# Altium schematic sheet analog.SchDoc
size A4
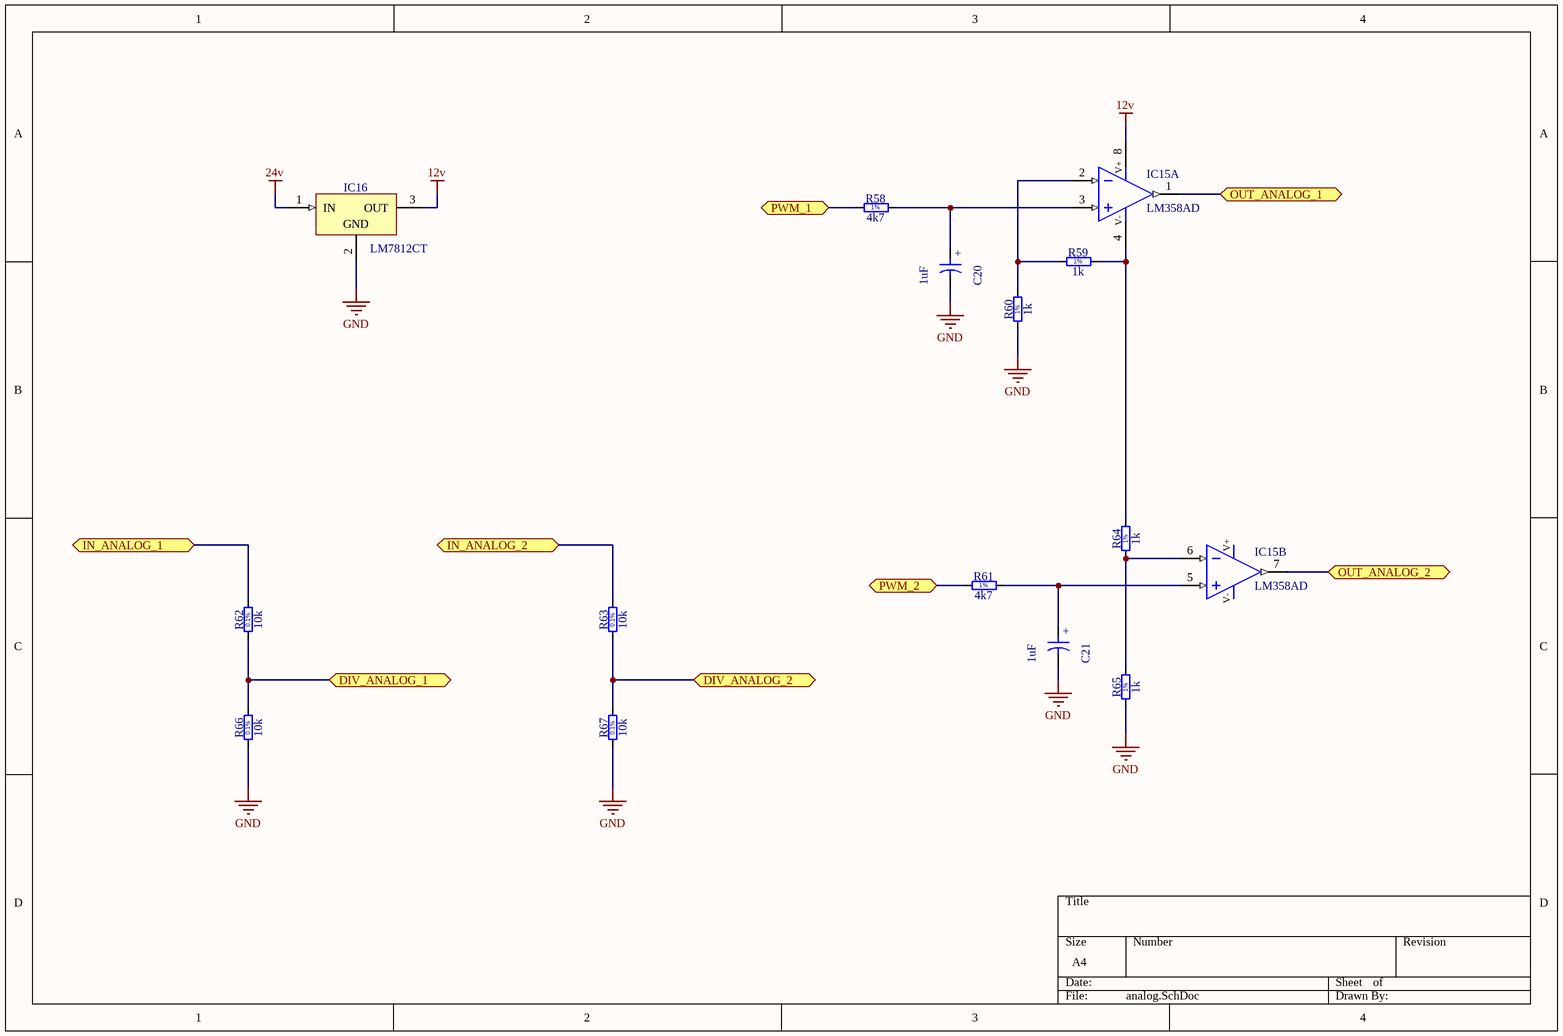
[diagram p0: analog.SchDoc]

## Parts
C20  1uF  [CAPPRB254-450X710]
C21  1uF  [CAPPRB254-450X710]
IC15  LM358AD  [SOIC127P600X175-8N]  (parts A,B of 2)
IC16  LM7812CT  [TO-220-V]
R58  4k7  [RESC2012X60N]
R59  1k  [RESC2012X60N]
R60  1k  [RESC2012X60N]
R61  4k7  [RESC2012X60N]
R62  10k  [RESC2012X60N]
R63  10k  [RESC2012X60N]
R64  1k  [RESC2012X60N]
R65  1k  [RESC2012X60N]
R66  10k  [RESC2012X60N]
R67  10k  [RESC2012X60N]

## Ports
DIV_ANALOG_1, DIV_ANALOG_2, IN_ANALOG_1, IN_ANALOG_2, OUT_ANALOG_1, OUT_ANALOG_2, PWM_1, PWM_2

## Nets
12v: IC15.8(V+) IC16.3(OUT)
24v: IC16.1(IN)
GND: C20.2 C21.2 IC16.2(GND) R60.1 R65.1 R66.1 R67.1
DIV_ANALOG_1: R62.1 R66.2 ; port DIV_ANALOG_1
DIV_ANALOG_2: R63.1 R67.2 ; port DIV_ANALOG_2
IN_ANALOG_1: R62.2 ; port IN_ANALOG_1
IN_ANALOG_2: R63.2 ; port IN_ANALOG_2
OUT_ANALOG_1: IC15.1(OUT) ; port OUT_ANALOG_1
OUT_ANALOG_2: IC15.7(OUT) ; port OUT_ANALOG_2
PWM_1: R58.1 ; port PWM_1
PWM_2: R61.1 ; port PWM_2
NetC20_1: C20.1 IC15.3(IN+) R58.2
NetC21_1: C21.1 IC15.5(IN+) R61.2
NetIC15_2: IC15.2(IN-) R59.1 R60.2
NetIC15_4: IC15.4(V-) R59.2 R64.2
NetIC15_6: IC15.6(IN-) R64.1 R65.2

## Notes on the sheet
- (in symbol CTEB_1UF_35V_10%_254-450X710) +
- (in symbol R0805_1K_1%_0.33W_100PPM_VISHAY_CRCW-HP) 1%
- (in symbol R0805_4K7_1%_0.125W_100PPM) 1%
- (in symbol R0805_10K_0.1%_0.1W_10PPM) 0.1%

## Library data of the parts
C20 C21 = CTEB_1UF_35V_10%_254-450X710: Polarised capacitor; Part Description: Solid Tantalum Resin Dipped Capacitor; Manufacturer: KEMET; Manufacturer Part Number: T350A105K035AT; Voltage: 35V; Tolerance: ±10%; Table: Capacitors THD; Part Number: CTEB_1UF_35V_10%_254-450X710; Component Kind: Standard; Component Type: Standard; Pin Count: 2; Value: 1uF; Status: None; Case: LS2.54 D4.5 x H7.1; Mounted: Yes; Socket: No; SMD: No; ComponentHeight: 7.1mm; HelpURL: \\cern.ch\dfs\Applications\Altium\Datasheets\CTEB_KEMET_T350.pdf; Author: CERN DEM JLC; CreateDate: 16/12/2009; LatestRevisionDate: 16/12/2009
IC15 = LM358AD: Dual Operational Amplifier; Manufacturer: TEXAS INSTRUMENTS; Table: Operational Amplifiers; Part Number: LM358AD; Component Kind: Standard; Component Type: Standard; Device: LM358AD; PackageDescription: SOIC 8, Pitch 1.27mm - Body 4x5mm, IPC Medium Density; Part Description: Dual Operational Amplifier; Manufacturer Part Number: LM358AD; Pin Count: 8; Case: SOIC8; Mounted: Yes; Socket: No; SMD: Yes; ComponentHeight: 1.75mm; Author: CERN DEM JLC; HelpURL: \\cern.ch\dfs\Applications\Altium\Datasheets\LM358AD.pdf; CreateDate: 02/12/2008; LatestRevisionDate: 13/04/2010
IC16 = LM7812CT_v: 3-Terminal Regulator 1=IN 2=GND 3=OUT; Part Description: 3-Terminal 12V 1A Positive Voltage Regulator; Manufacturer: FAIRCHILD SEMICONDUCTOR; Table: Regulators; Part Number: LM7812CT_v; Component Kind: Standard; Component Type: Standard; Device: LM7812CT; PackageDescription: TO-220 3-Terminal + Tab - Horizontal Mount; Manufacturer Part Number: LM7812CT; Pin Count: 3; Case: TO-220; Mounted: Yes; Socket: No; SMD: No; ComponentHeight: 18.95mm; HelpURL: \\cern.ch\dfs\Applications\Altium\Datasheets\LM7812CT.pdf; Author: CERN DEM JLC; CreateDate: 29/10/2008; LatestRevisionDate: 29/10/2008
R58 R61 = R0805_4K7_1%_0.125W_100PPM: Resistor - 1%; Part Description: General Purpose Thick Film Chip Resistor; Manufacturer: GENERIC; Manufacturer1 Part Number: NRC10F4701TRF; Power: 0.125W; TC: ±100ppm/°C; Table: Resistors SMD; Part Number: R0805_4K7_1%_0.125W_100PPM; Component Kind: Standard; Component Type: Standard; Pin Count: 2; Value: 4k7; Status: Preferred; Tolerance: ±1%; Manufacturer Part Number: R0805_4K7_1%_0.125W_100PPM; Case: 0805; Mounted: Yes; Socket: No; SMD: Yes; Manufacturer1 Example: NIC COMPONENT; Manufacturer1 ComponentHeight: 0.6mm; HelpURL: \\cern.ch\dfs\Applications\Altium\Datasheets\R0805_NIC_NRC.pdf; Author: CERN DEM JLC; CreateDate: 03/12/2007; LatestRevisionDate: 13/03/2008
R59 R60 R64 R65 = R0805_1K_1%_0.33W_100PPM_VISHAY_CRCW-HP: Resistor - 1%; Part Description: Pulse Proof, High Power Thick Film Chip Resistor; Manufacturer: VISHAY; Manufacturer Part Number: CRCW08051K00FKEAHP; Power: 0.33W; TC: ±100ppm/°C; Table: Resistors SMD; Part Number: R0805_1K_1%_0.33W_100PPM_VISHAY_CRCW-HP; Component Kind: Standard; Component Type: Standard; Pin Count: 2; Value: 1k; Status: None; Tolerance: ±1%; Case: 0805; Mounted: Yes; Socket: No; SMD: Yes; Manufacturer1 ComponentHeight: 0.6mm; HelpURL: \\cern.ch\dfs\Applications\Altium\Datasheets\R0805_VISHAY_CRCW-HP e3.pdf; Author: CERN DEM JLC; CreateDate: 16/06/2010; LatestRevisionDate: 16/06/2010
R62 R63 R66 R67 = R0805_10K_0.1%_0.1W_10PPM: Resistor - 0.1%; Part Description: Thin Film Chip Resistor; Manufacturer: GENERIC; Manufacturer1 Part Number: RN73C2A10KBTG; Power: 0.1W; TC: ±10ppm; Table: Resistors SMD; Part Number: R0805_10K_0.1%_0.1W_10PPM; Component Kind: Standard; Component Type: Standard; Pin Count: 2; Value: 10k; Status: Not recommended; Tolerance: ±0.1%; Manufacturer Part Number: R0805_10K_0.1%_0.1W_10PPM; Case: 0805; Mounted: Yes; Socket: No; SMD: Yes; Manufacturer1 Example: TYCO HOLSWORTHY; Manufacturer1 ComponentHeight: 0.6mm; HelpURL: \\cern.ch\dfs\Applications\Altium\Datasheets\R0805_Tyco_RN73.pdf; Author: CERN DEM JLC; CreateDate: 03/12/2007; LatestRevisionDate: 13/03/2008